# EAGLE schematic BMS Master Teensy V 2.22 move 4G (EAGLE 7.2.0)
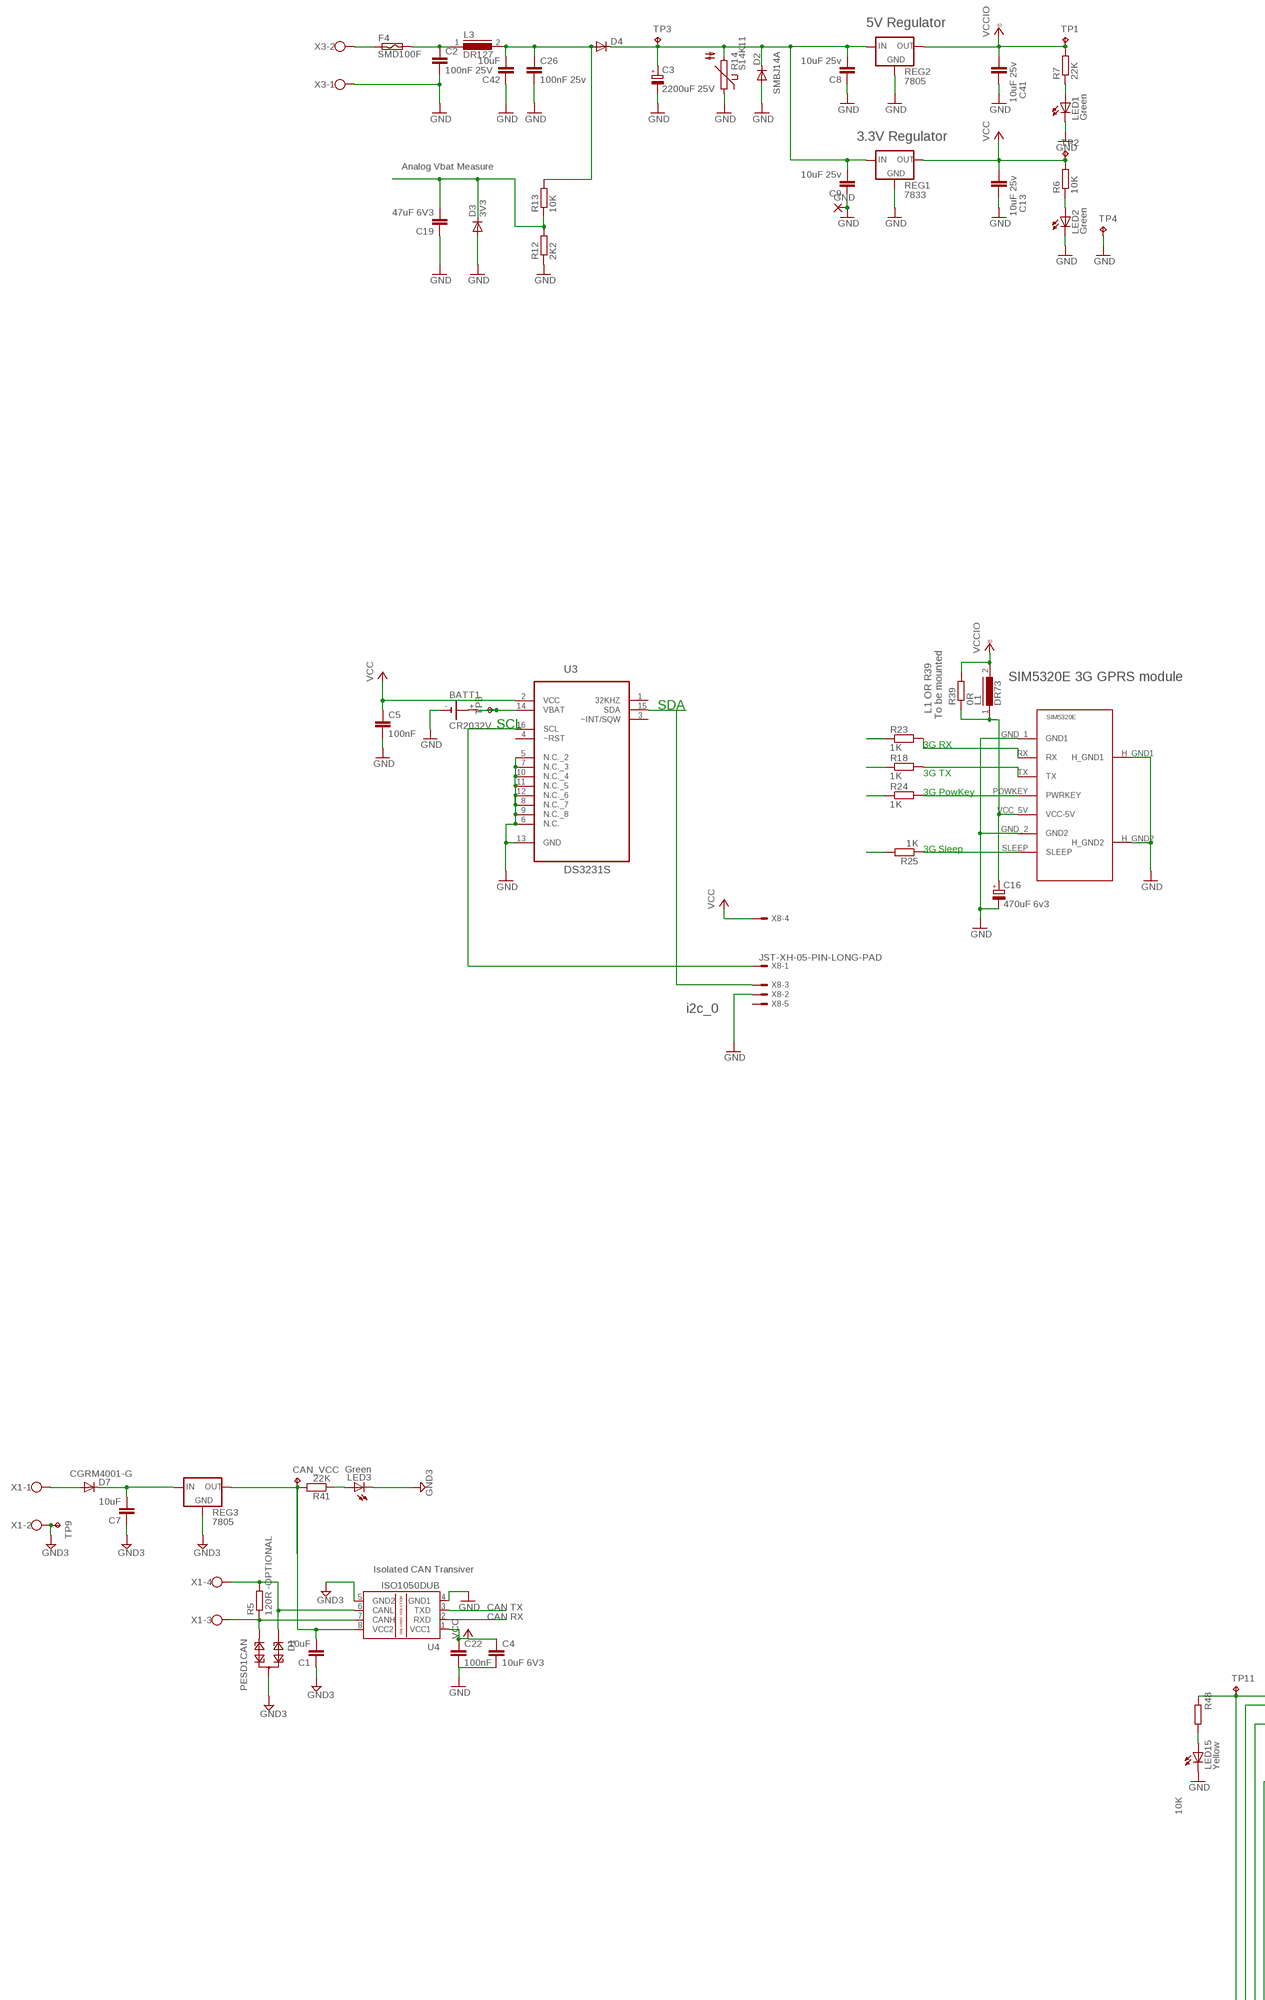
[diagram p0: schematic, sheet 1, part 1 of 3]
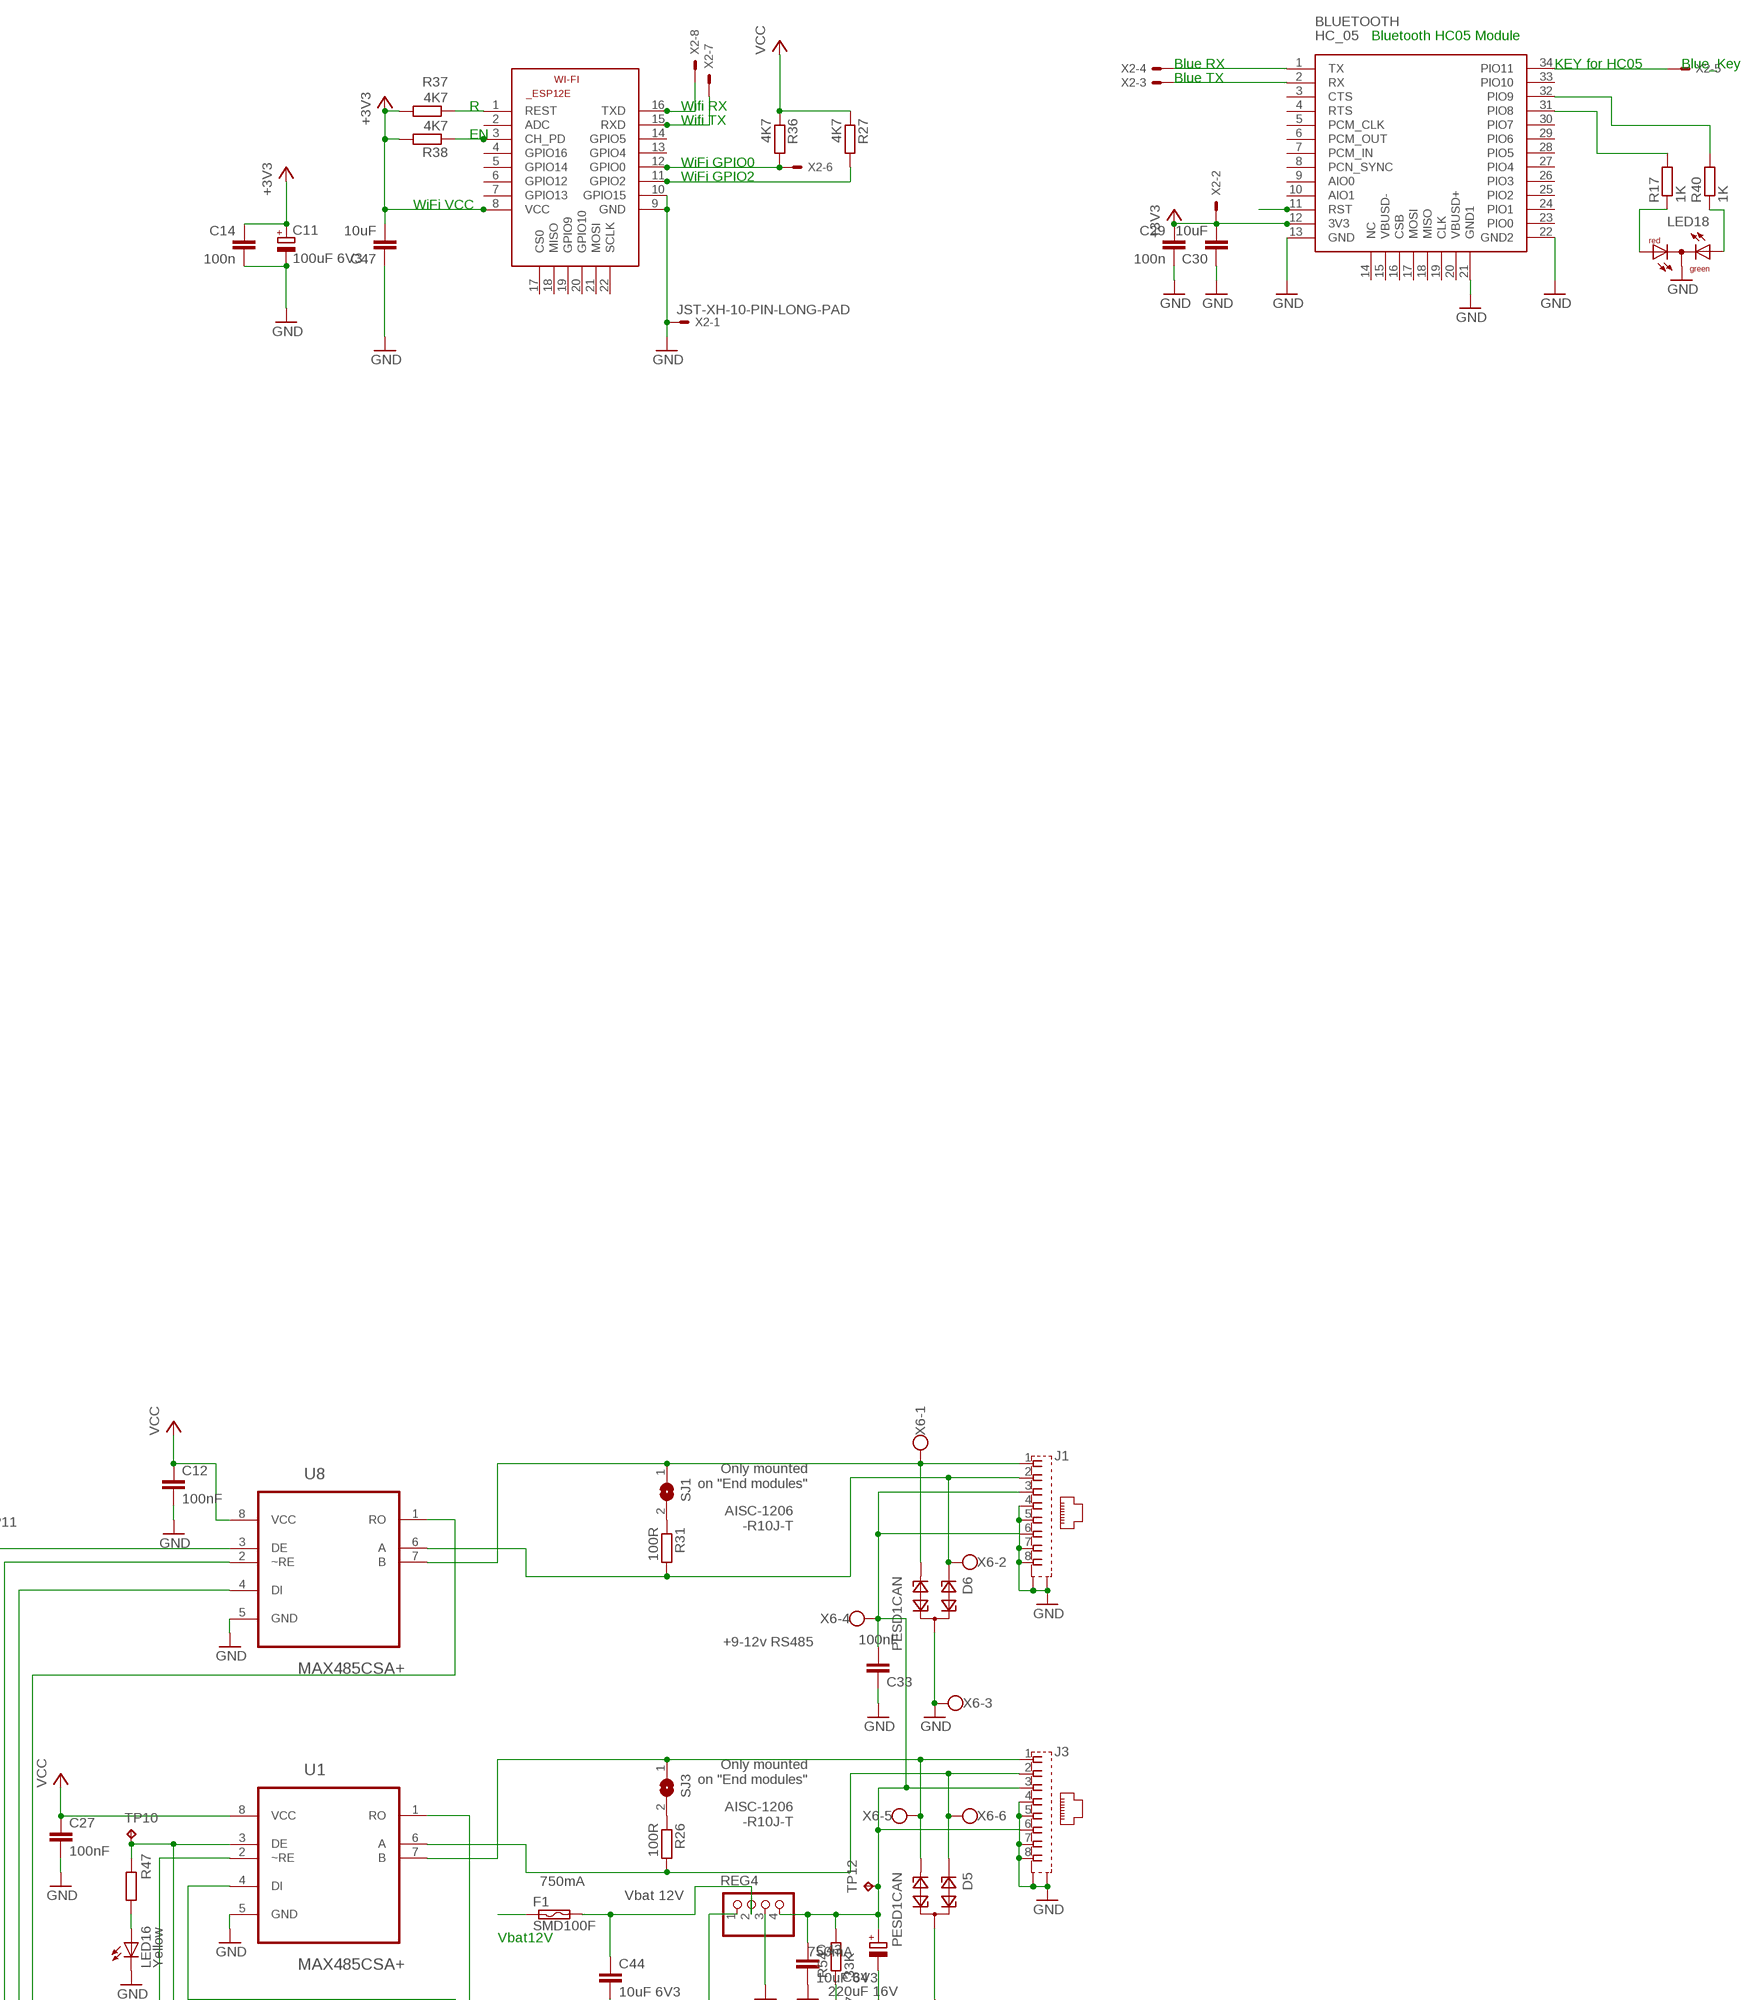
[diagram p1: schematic, sheet 1, part 2 of 3]
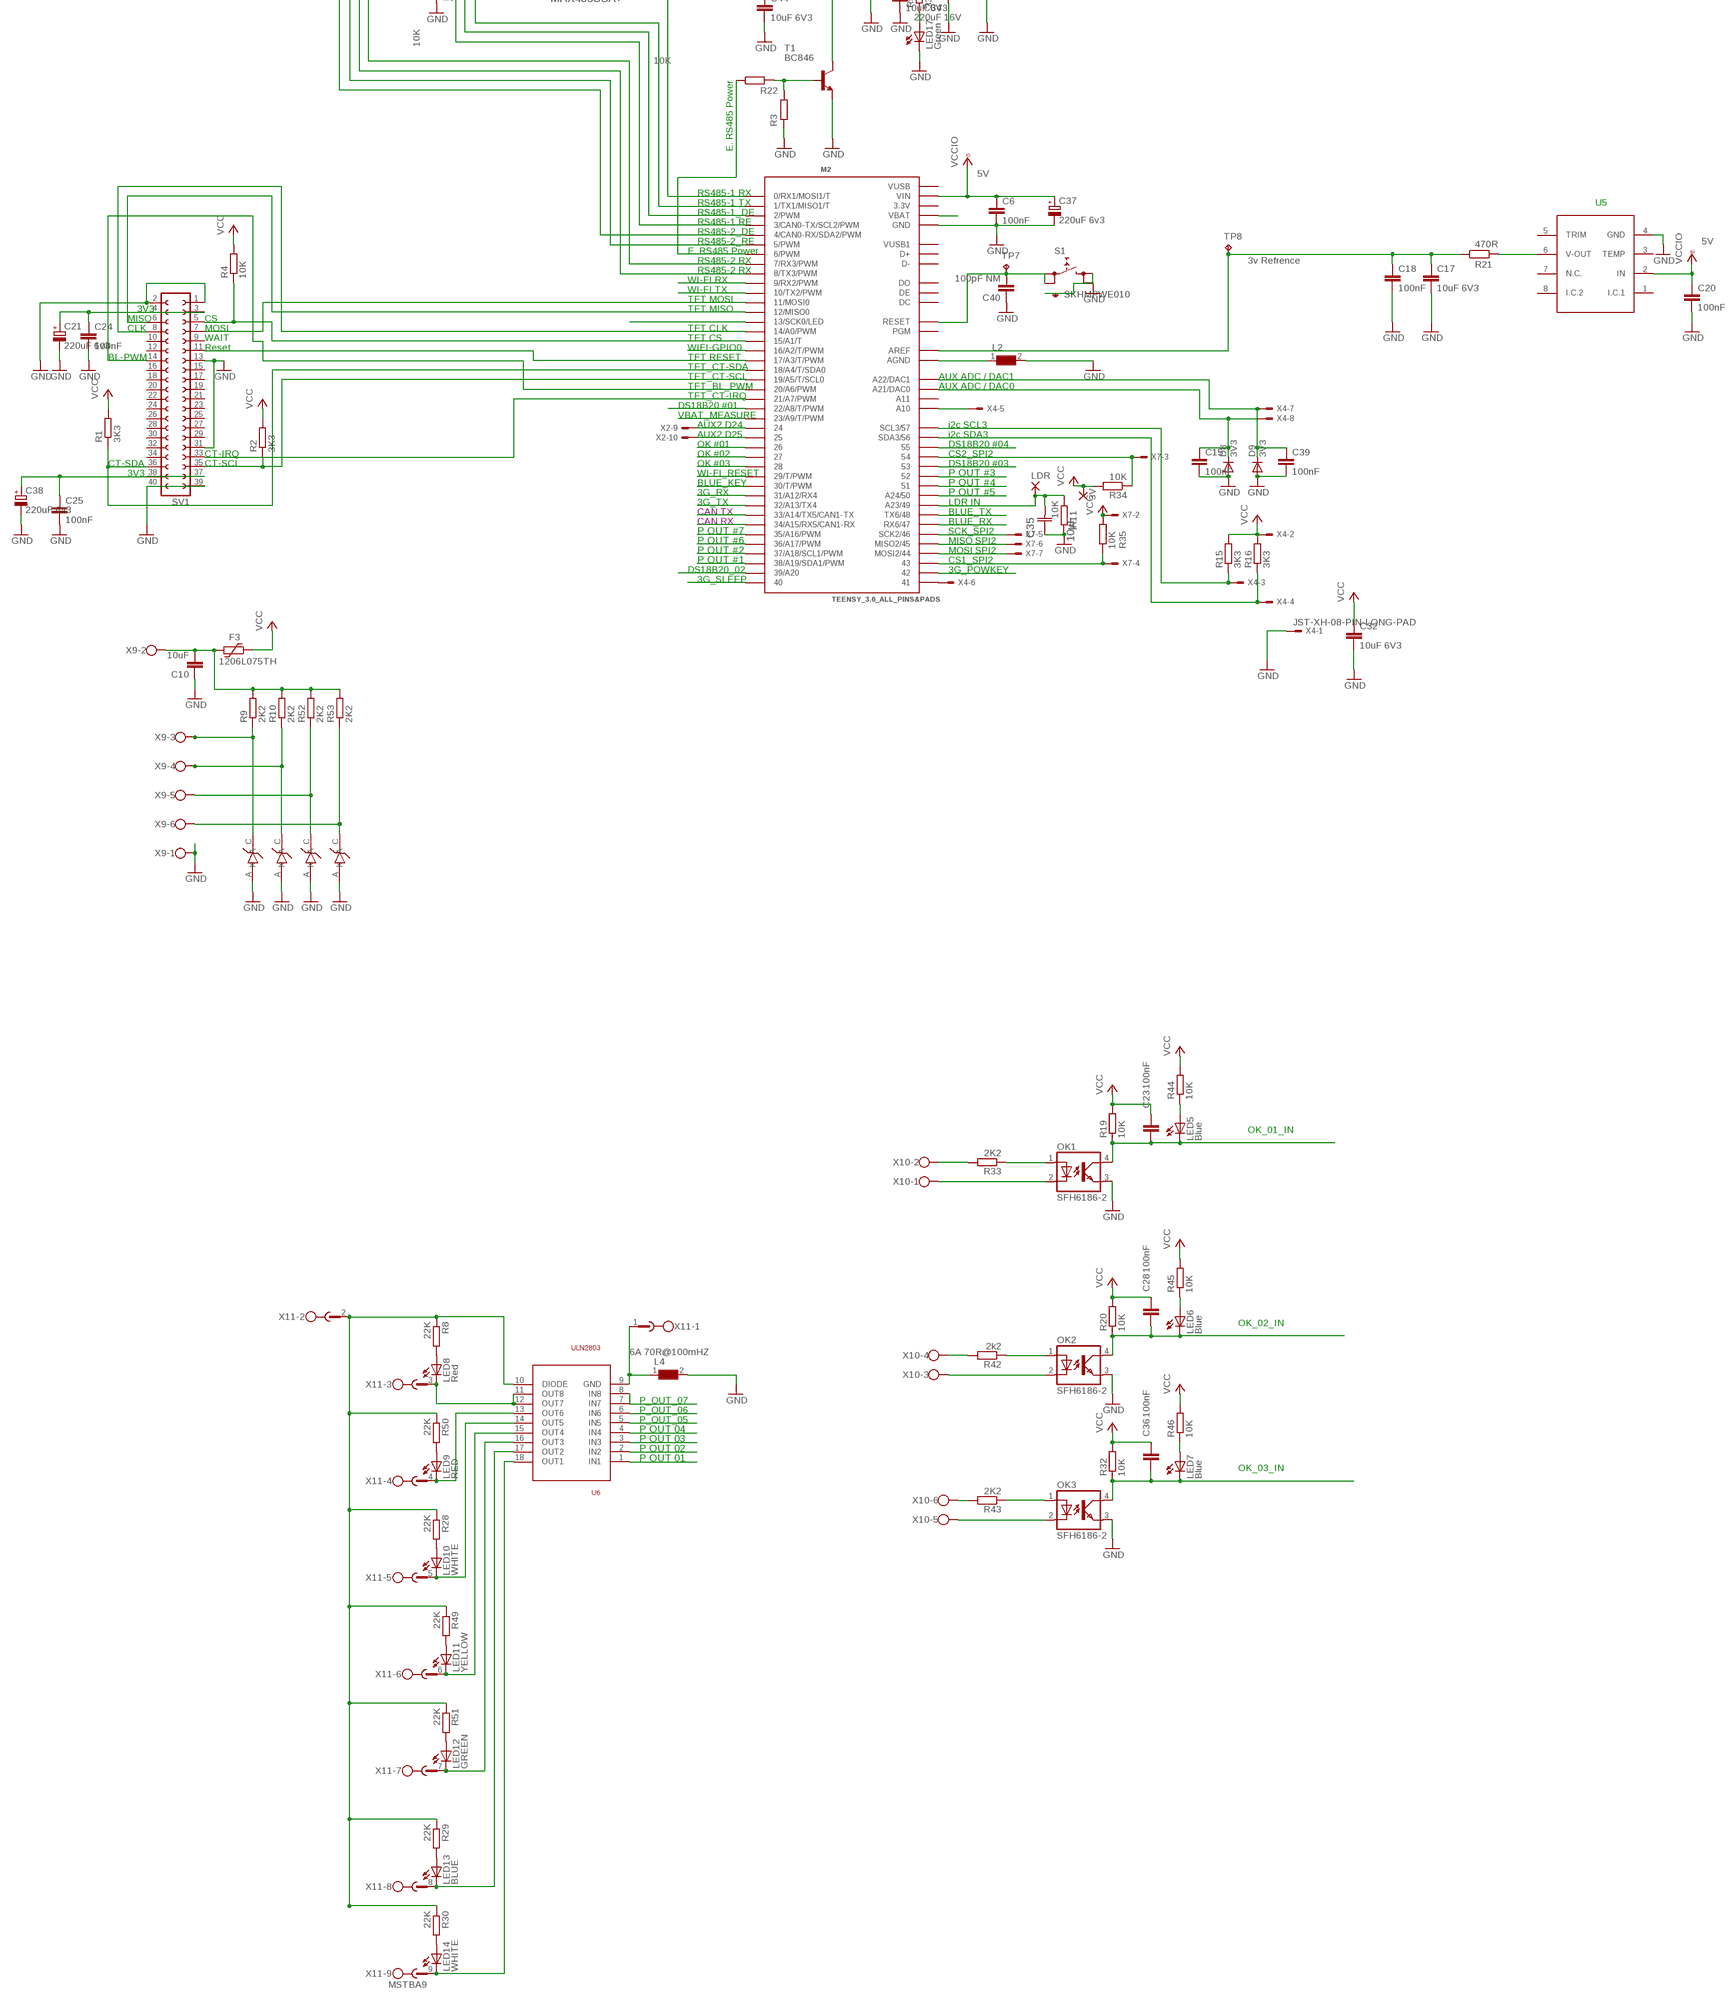
[diagram p2: schematic, sheet 1, part 3 of 3]

## Parts
3V  1,6/0,8  [1,6/0,8]
BATT1  CR2032V  [CR2032V]
BLUETOOTH  HC_05  [BLUETOOTH_SMD]
C1  10uF  C-EUC1206  [C1206]
C2  100nF 25V  C-EUC0805  [C0805]
C3  2200uF 25V  CPOL-EUE5-10.5  [E5-10,5]
C4  10uF 6V3  C-EUC1206  [C1206]
C5  100nF  C-EUC0603  [C0603]
C6  100nF  C-EUC0603  [C0603]
C7  10uF  C-EUC1206  [C1206]
C8  10uF 25v  C-EUC1206  [C1206]
C9  10uF 25v  C-EUC1206  [C1206]
C10  10uF  C-EUC1206  [C1206]
C11  100uF 6V3  CPOL-EUCT6032  [CT6032]
C12  100nF  C-EUC0603  [C0603]
C13  10uF 25v  C-EUC1206  [C1206]
C14  100n  C-EU0603-RND  [C0603-ROUND]
C15  100nF  C-EUC0603  [C0603]
C16  470uF 6v3  CPOL-EUCT7343  [CT7343]
C17  10uF 6V3  C-EUC1206  [C1206]
C18  100nF  C-EUC0603  [C0603]
C19  47uF 6V3  C-EUC1206  [C1206]
C20  100nF  C-EUC0603  [C0603]
C21  220uF 6v3  CPOL-EUCT7343  [CT7343]
C22  100nF  C-EUC0603  [C0603]
C23  100nF  C-EUC0805  [C0805]
C24  100nF  C-EUC0603  [C0603]
C25  100nF  C-EUC0603  [C0603]
C26  100nF 25v  C-EUC0603  [C0603]
C27  100nF  C-EUC0603  [C0603]
C28  100nF  C-EUC0805  [C0805]
C29  100n  C-EU0603-RND  [C0603-ROUND]
C30  10uF  C-EUC1206  [C1206]
C32  10uF 6V3  C-EUC1206  [C1206]
C33  100nF  C-EUC0603  [C0603]
C34  220uF 16V  CPOL-EUCT7343  [CT7343]
C35  10µF  0805ZD106KAT4A  [CAPC2012X140N]
C36  100nF  C-EUC0805  [C0805]
C37  220uF 6v3  CPOL-EUCT7343  [CT7343]
C38  220uF 6v3  CPOL-EUCT7343  [CT7343]
C39  100nF  C-EUC0603  [C0603]
C40  100pF NM  C-EUC0603  [C0603]
C41  10uF 25v  C-EUC1206  [C1206]
C42  10uF  C-EUC1206  [C1206]
C43  10uF 6V3  C-EUC1206  [C1206]
C44  10uF 6V3  C-EUC1206  [C1206]
C47  10uF  C-EUC1206  [C1206]
CAN_VCC  TPB2,54  [B2,54]
D1  PESD1CAN  [SOT23]
D2  SMBJ14A  DIODE-DO214AC  [DO214AC]
D3  3V3  DIODE-SOD80C  [SOD80C]
D4  DIODE-SMC  [SMC]
D5  PESD1CAN  [SOT23]
D6  PESD1CAN  [SOT23]
D7  CGRM4001-G  [SOD-123_MINI-SMA]
D8  3V3  DIODE-SOD80C  [SOD80C]
D9  3V3  DIODE-SOD80C  [SOD80C]
D10  SOD-323_ZENER_DIODE  [SOD323_ST]
D11  SOD-323_ZENER_DIODE  [SOD323_ST]
D12  SOD-323_ZENER_DIODE  [SOD323_ST]
D13  SOD-323_ZENER_DIODE  [SOD323_ST]
F1  SMD100F  [SMD050F]
F3  1206L075TH  [1206L]
F4  SMD100F  [SMD050F]
GND  1,6/0,9  [1,6/0,9]
J1  555153-1  [555153-1]
J3  555153-1  [555153-1]
L1  DR73  [DR73]
L2  WE-CBF-74279201_0805  [0805]
L3  DR127  [DR127]
L4  WE-CBF-742792510_1812  [1812]
LDR  1,6/0,8  [1,6/0,8]
LED1  Green  LEDCHIPLED_0805  [CHIPLED_0805]
LED2  Green  LEDCHIPLED_0805  [CHIPLED_0805]
LED3  Green  LEDCHIPLED_0805  [CHIPLED_0805]
LED5  Blue  LEDCHIPLED_0805  [CHIPLED_0805]
LED6  Blue  LEDCHIPLED_0805  [CHIPLED_0805]
LED7  Blue  LEDCHIPLED_0805  [CHIPLED_0805]
LED8  Red  LEDCHIP-LED0805  [CHIP-LED0805]
LED9  RED  LEDCHIP-LED0805  [CHIP-LED0805]
LED10  WHITE  LEDCHIP-LED0805  [CHIP-LED0805]
LED11  YELLOW  LEDCHIP-LED0805  [CHIP-LED0805]
LED12  GREEN  LEDCHIP-LED0805  [CHIP-LED0805]
LED13  BLUE  LEDCHIP-LED0805  [CHIP-LED0805]
LED14  WHITE  LEDCHIP-LED0805  [CHIP-LED0805]
LED15  Yellow  LEDCHIPLED_0805  [CHIPLED_0805]
LED16  Yellow  LEDCHIPLED_0805  [CHIPLED_0805]
LED17  Green  LEDCHIPLED_0805  [CHIPLED_0805]
LED18  DUOLED-RG-C  [DUOLED-C-5MM]
M1  SIM5320_MODULE  [SIM5320E_MODULE]
M2  TEENSY_3.6_ALL_PINS&PADS  [TEENSY_3.6_ALL_PINS&PADS]
OK1  SFH6186-2  [SMD4-7]
OK2  SFH6186-2  [SMD4-7]
OK3  SFH6186-2  [SMD4-7]
R1  3K3  R-EU_R0603  [R0603]
R2  3K3  R-EU_R0603  [R0603]
R3  1M  R-EU_R0603  [R0603]
R4  10K  R-EU_R0603  [R0603]
R5  120R -OPTIONAL  R-EU_R0603  [R0603]
R6  10K  R-EU_R0805  [R0805]
R7  22K  R-EU_R0805  [R0805]
R8  22K  R-EU_R0603  [R0603]
R9  2K2  R-EU_R0603  [R0603]
R10  2K2  R-EU_R0603  [R0603]
R11  10K  R-EU_R0603  [R0603]
R12  2K2  R-EU_R0603  [R0603]
R13  10K  R-EU_R0603  [R0603]
R14  S14K11  [S14K11]
R15  3K3  R-EU_R0603  [R0603]
R16  3K3  R-EU_R0603  [R0603]
R17  1K  R-EU_R0603  [R0603]
R18  1K  R-EU_R0603  [R0603]
R19  10K  R-EU_R0805  [R0805]
R20  10K  R-EU_R0805  [R0805]
R21  470R  R-EU_R0603  [R0603]
R22  10K  R-EU_R0603  [R0603]
R23  1K  R-EU_R0603  [R0603]
R24  1K  R-EU_R0603  [R0603]
R25  1K  R-EU_R0603  [R0603]
R26  100R  R-EU_R0805  [R0805]
R27  4K7  R-EU_R0603  [R0603]
R28  22K  R-EU_R0603  [R0603]
R29  22K  R-EU_R0603  [R0603]
R30  22K  R-EU_R0603  [R0603]
R31  100R  R-EU_R0805  [R0805]
R32  10K  R-EU_R0805  [R0805]
R33  2K2  R-EU_R0805  [R0805]
R34  10K  R-EU_R0603  [R0603]
R35  10K  R-EU_R0603  [R0603]
R36  4K7  R-EU_R0603  [R0603]
R37  4K7  R-EU_R0603  [R0603]
R38  4K7  R-EU_R0603  [R0603]
R39  0R  R-EU_R0603  [R0603]
R40  1K  R-EU_R0603  [R0603]
R41  22K  R-EU_R0805  [R0805]
R42  2k2  R-EU_R0805  [R0805]
R43  2K2  R-EU_R0805  [R0805]
R44  10K  R-EU_R0805  [R0805]
R45  10K  R-EU_R0805  [R0805]
R46  10K  R-EU_R0805  [R0805]
R47  10K  R-EU_R0603  [R0603]
R48  10K  R-EU_R0603  [R0603]
R49  22K  R-EU_R0603  [R0603]
R50  22K  R-EU_R0603  [R0603]
R51  22K  R-EU_R0603  [R0603]
R52  2K2  R-EU_R0603  [R0603]
R53  2K2  R-EU_R0603  [R0603]
R54  33K  R-EU_R0805  [R0805]
REG1  7833  78XXS  [78XXS]
REG2  7805  78XXS  [78XXS]
REG3  7805  78XXS  [78XXS]
REG4  PINHD-1X4  [1X04]
S1  SKHMPWE010  [SKHMPXE010]
SJ1  SJ  [SJ]
SJ3  SJ  [SJ]
SV1  FE20-2  [FE20-2]
T1  BC846  [SOT23]
TP1  TPB2,54  [B2,54]
TP2  TPB2,54  [B2,54]
TP3  TPB2,54  [B2,54]
TP4  TPB2,54  [B2,54]
TP5  TPB2,54  [B2,54]
TP7  TPB2,54  [B2,54]
TP8  TPB2,54  [B2,54]
TP9  TPB2,54  [B2,54]
TP10  TPB1,27  [B1,27]
TP11  TPB1,27  [B1,27]
TP12  TPB2,54  [B2,54]
U1  MAX485CSA+  [SOIC127P600X175-8N]
U3  DS3231S  [SOIC127P1032X265-16N]
U4  ISO1050DUB  [DUB-R-PDSO-G8]
U5  U5  MAX6177AASA+  [MAX6177AASA+]
U6  ULN2803  [SO18L]
U8  MAX485CSA+  [SOIC127P600X175-8N]
WI-FI  ESP8266-12EESP12E  [ESP8266-ESP12E]
X1  W237-4  [W237-4]
X2  JST-XH-10-PIN-LONG-PAD  [JST-XH-10-PACKAGE-LONG-PAD]
X3  W237-102  [W237-102]
X4  JST-XH-08-PIN-LONG-PAD  [JST-XH-08-PACKAGE-LONG-PAD]
X6  W237-6  [W237-6]
X7  JST-XH-07-PIN-LONG-PAD  [JST-XH-07-PACKAGE-LONG-PAD]
X8  JST-XH-05-PIN-LONG-PAD  [JST-XH-05-PACKAGE-LONG-PAD]
X9  W237-6  [W237-6]
X10  W237-6  [W237-6]
X11  MSTBA9  [MSTBA9]

## Nets
3G_POWKEY: M2.42 R24.1
3G_RX: M2.31/A12(31/A12/RX4) R18.1
3G_SLEEP: M2.40 R25.2
3G_TX: M2.32/A13(32/A13/TX4) R23.1
18B20_VCC [power]: C10.2 F3.2 R9.2 R10.2 R52.2 R53.2 X9.2
A10: M2.A10 X4.5
A- [RS485 Differential]: D5.1 J3.2 R26.2 U1.6(A) X6.6
A-1 [RS485 Differential]: D6.1 J1.2 R31.2 U8.6(A) X6.2
AUX_ADC-DAC_1: C39.1 D9.C M2.A22(A22/DAC1) X4.7
B+ [RS485 Differential]: D5.2 J3.1 SJ3.1 U1.7(B) X6.5
B+1 [RS485 Differential]: D6.2 J1.1 SJ1.1 U8.7(B) X6.1
BL-PWM: M2.20/A6(20/A6/PWM) SV1.14
BLUE_KEY: BLUETOOTH.34(PIO11) M2.30(30/T/PWM) X2.5
BLUE_RX: BLUETOOTH.1(TX) M2.47(RX6/47) X2.4
BLUE_TX: BLUETOOTH.2(RX) M2.48(TX6/48) X2.3
CAN-L [RS485 Differential]: D1.1 R5.2 U4.6(CANL) X1.4
CAN_RX [RS485 Differential]: M2.34/A15(34/A15/RX5/CAN1-RX) U4.2(RXD)
CAN_TX [RS485 Differential]: M2.33/A14(33/A14/TX5/CAN1-TX) U4.3(TXD)
CAN_VBAT_12V [power]: D7.A X1.1
CHARGE_A(1): C15.1 D8.C M2.A21(A21/DAC0) X4.8
CS1_SPI2: M2.43 R35.1 X7.4
CS2_SPI2: M2.54 R34.1 X7.3
CT-IRQ: M2.21/A7(21/A7/PWM) SV1.33
D24: M2.24 X2.9
D25: M2.25 X2.10
D41: M2.41 X4.6
DCIN [power]: C33.1 C34.+ C43.1 J1.3 J1.6 J3.3 J3.6 R54.2 REG4.4 TP12.TP X6.4
DS18B20_01: D13.C(K) M2.22/A8(22/A8/T/PWM) R9.1 X9.3
DS18B20_02: D12.C(K) M2.39/A20 R10.1 X9.4
DS18B20_03: D11.C(K) M2.53 R52.1 X9.5
DS18B20_04: D10.C(K) M2.55 R53.1 X9.6
E_RS485_POWER: M2.6(6/PWM) R22.1
GND: BATT1.- BLUETOOTH.13(GND) BLUETOOTH.21(GND1) BLUETOOTH.22(GND2) C2.2 C3.- C4.2 C5.2 C6.2 C8.1 C9.1 C10.1 C11.- C12.2 C13.1 C14.2 C15.2 C16.- C17.2 C18.2 C19.1 C20.2 C21.- C22.2 C24.2 C25.2 C26.2 C27.2 C29.2 C30.1 C32.2 C33.2 C34.- C35.1(C1) C37.- C38.- C39.2 C40.1 C41.1 C42.1 C43.2 C44.2 C47.1 D2.A D3.A D5.3 D6.3 D8.A D9.A D10.A D11.A D12.A D13.A GND.1(P) J1.4 J1.5 J1.7 J1.8 J1.G1(S1) J1.G2(S2) J3.4 J3.5 J3.7 J3.8 J3.G1(S1) J3.G2(S2) L2.2 L4.2 LED1.C LED2.C LED15.C LED16.C LED17.C LED18.C M1.GND_1(GND1) M1.GND_2(GND2) M1.H_GND1 M1.H_GND2 M2.GND M2.GND1(GND) M2.GND2(GND) M2.GND3(GND) M2.GND4(GND) M2.GND5(GND) M2.GND6(GND) OK1.3(EMIT) OK2.3(EMIT) OK3.3(EMIT) R3.2 R11.2 R12.1 R14.1 REG1.GND REG2.GND REG4.3 S1.3(2.1) S1.4(2.2) S1.5(SH) SV1.1 SV1.2 SV1.13 SV1.31 SV1.39 SV1.40 T1.2(E) TP4.TP U1.5(GND) U3.5(N.C._2) U3.6(N.C.) U3.7(N.C._3) U3.8(N.C._7) U3.9(N.C._8) U3.10(N.C._4) U3.11(N.C._5) U3.12(N.C._6) U3.13(GND) U4.4(GND1) U5.4(GND) U8.5(GND) WI-FI.9(GND) WI-FI.10(GPIO15) X2.1 X3.1 X4.1 X6.3 X8.2 X9.1
GND3-CAN: C1.1 C7.1 D1.3 LED3.C REG3.GND TP9.TP U4.5(GND2) X1.2 ; supply symbol labelled GND3
GND-FILTERED: L4.1 U6.9(GND) X11.1
LDR_A23: C35.2(C2) LDR.1(P) M2.49(A23/49) R11.1
MISO_SPI2: M2.45(MISO2/45) X7.6
MOSI_SPI2: M2.44(MOSI2/44) X7.7
N$1: M2.0(0/RX1/MOSI1/T) U1.1(RO)
N$2: M2.1(1/TX1/MISO1/T) U1.4(DI)
N$4: L2.1 M2.AGND
N$6: LED17.A R54.1
N$7 [power]: C2.1 F4.2 L3.1
N$8: LED16.A R47.1
N$9: R3.1 R22.2 T1.1(B)
N$10: LED15.A R48.1
N$11 [power]: F4.1 X3.2
N$12: LED11.A R49.2
N$13 [power]: BATT1.+ TP5.TP U3.14(VBAT)
N$14: M1.TX R18.2
N$15: LED18.AR R17.1
N$16: M2.VBAT
N$17: LED3.A R41.1
N$18: LED9.A R50.2
N$19: M1.RX R23.2
N$20 [RS485 Differential]: D1.2 R5.1 U4.7(CANH) X1.3
N$21: LED18.AX(AG) R40.1
N$22: LED12.A R51.2
N$23: LED2.A R6.1
N$24: LED1.A R7.1
N$25 [power]: C44.1 F1.2 REG4.2
N$26: M2.13(13/SCK0/LED)
N$27: LED8.A R8.2
N$31: OK1.1(A) R33.1
N$32: BLUETOOTH.11(RST)
N$33: R33.2 X10.2
N$34: OK3.1(A) R43.1
N$35: R43.2 X10.6
N$36: R42.2 X10.4
N$37: BLUETOOTH.32(PIO9) R40.2
N$38: BLUETOOTH.31(PIO8) R17.2
N$39: R26.1 SJ3.2
N$42: R21.2 U5.6(V-OUT)
N$45: M1.POWKEY(PWRKEY) R24.2
N$46: M1.SLEEP R25.1
N$49: OK2.2(C) X10.3
N$50: OK3.2(C) X10.5
N$51 [power]: C7.2 D7.C REG3.IN
N$52: LED10.A R28.2
N$53: LED13.A R29.2
N$54: LED14.A R30.2
N$55: OK1.2(C) X10.1
N$56: OK2.1(A) R42.1
N$58: LED5.A R44.1
N$59: LED6.A R45.1
N$60: R31.1 SJ1.2
N$62: LED7.A R46.1
OK_01_IN: C23.2 LED5.C M2.26 OK1.4(COL) R19.1
OK_02_IN: C28.2 LED6.C M2.27 OK2.4(COL) R20.1
OK_03_IN: C36.2 LED7.C M2.28 OK3.4(COL) R32.1
OUT_01: LED14.C U6.18(OUT1) X11.9
OUT_02 [power]: LED13.C U6.17(OUT2) X11.8
OUT_03 [power]: LED12.C U6.16(OUT3) X11.7
OUT_04 [power]: LED11.C U6.15(OUT4) X11.6
OUT_05 [power]: LED10.C U6.14(OUT5) X11.5
OUT_06 [power]: LED9.C U6.13(OUT6) X11.4
OUT_07 [power]: LED8.C U6.11(OUT8) U6.12(OUT7) X11.3
OUT_VCC_VOLTAGE [power]: R8.1 R28.1 R29.1 R30.1 R49.1 R50.1 R51.1 U6.10(DIODE) X11.2
P_OUT_01: M2.38/A19(38/A19/SDA1/PWM) U6.1(IN1)
P_OUT_02: M2.37/A18(37/A18/SCL1/PWM) U6.2(IN2)
P_OUT_03: M2.52 U6.3(IN3)
P_OUT_04: M2.51 U6.4(IN4)
P_OUT_05: M2.50(A24/50) U6.5(IN5)
P_OUT_06: M2.36/A17(36/A17/PWM) U6.6(IN6)
P_OUT_07: M2.35/A16(35/A16/PWM) U6.7(IN7) U6.8(IN8)
RESET [power]: C40.2 M2.RESET S1.1(1.1) S1.2(1.2) TP7.TP
RS485-1_DE: M2.2(2/PWM) R47.2 TP10.TP U1.3(DE)
RS485-1_RE: M2.3(3/CAN0-TX/SCL2/PWM) U1.2(~RE)
RS485-2_DE: M2.4(4/CAN0-RX/SDA2/PWM) R48.2 TP11.TP U8.3(DE)
RS485-2_RE: M2.5(5/PWM) U8.2(~RE)
RS485-2_RX: M2.7(7/RX3/PWM) U8.1(RO)
RS485-2_TX: M2.8(8/TX3/PWM) U8.4(DI)
RS485_POWER: REG4.1 T1.3(C)
SCK_SPI2: M2.46(SCK2/46) X7.5
SCL: M2.19/A5(19/A5/T/SCL0) R2.1 SV1.35 U3.16(SCL) X8.1
SCL3: M2.57(SCL3/57) R15.1 X4.3
SDA: M2.18/A4(18/A4/T/SDA0) R1.1 SV1.36 U3.15(SDA) X8.3
SDA3: M2.56(SDA3/56) R16.1 X4.4
SIM5320E_VCC [power]: C16.+ L1.1 M1.VCC_5V(VCC-5V) R39.1
TFT-SCK: M2.14/A0(14/A0/PWM) SV1.8
TFT_CS: M2.15/A1(15/A1/T) R4.1 SV1.5
TFT_MISO: M2.12(12/MISO0) SV1.6
TFT_MOSI: M2.11(11/MOSI0) SV1.7
TFT_RESET: M2.17/A3(17/A3/T/PWM) SV1.11
VBAT12V [power]: C3.+ C8.2 C9.2 D2.C D4.C F1.1 R14.2 REG1.IN REG2.IN TP3.TP
VBAT_12V [power]: C26.1 C42.2 D4.A L3.2 R13.2
VBAT_MEASURE: C19.2 D3.C M2.23/A9(23/A9/T/PWM) R12.2 R13.1
VCC3V1 [power]: C1.2 CAN_VCC.TP R41.2 REG3.OUT U4.8(VCC2)
VCC3V3 [power]: 3V.1(P) BLUETOOTH.12(3V3) C4.1 C5.1 C11.+ C12.1 C13.2 C14.1 C21.+ C22.1 C23.1 C24.1 C25.1 C27.1 C28.1 C29.1 C30.2 C32.1 C36.1 C38.+ C47.2 F3.1 R1.2 R2.2 R4.2 R6.2 R15.2 R16.2 R19.2 R20.2 R27.1 R32.2 R34.2 R35.2 R36.1 R37.2 R38.2 R44.2 R45.2 R46.2 REG1.OUT SV1.3 SV1.4 SV1.37 SV1.38 TP2.TP U1.8(VCC) U3.2(VCC) U4.1(VCC1) U8.8(VCC) WI-FI.8(VCC) X2.2 X4.2 X7.2 X8.4 ; supply symbol labelled VCC, +3V3
VCC5V [power]: C6.1 C20.1 C37.+ C41.2 L1.2 M2.VIN R7.2 R39.2 REG2.OUT TP1.TP U5.2(IN) ; supply symbol labelled VCCIO
VREF_3V: C17.1 C18.1 M2.AREF R21.1 TP8.TP
WI-FI_RESET: M2.29(29/T/PWM) R37.1 WI-FI.1(REST)
WI-FI_RX: M2.9(9/RX2/PWM) WI-FI.16(TXD) X2.8
WI-FI_TX: M2.10(10/TX2/PWM) WI-FI.15(RXD) X2.7
WIFI-CH_PD: R38.1 WI-FI.3(CH_PD)
WIFI-GPIO0: M2.16/A2(16/A2/T/PWM) R36.2 WI-FI.12(GPIO0) X2.6
WIFI-GPIO2: R27.2 WI-FI.11(GPIO2)
Unconnected: BATT1.+@1(+) BLUETOOTH.3(CTS) BLUETOOTH.4(RTS) BLUETOOTH.5(PCM_CLK) BLUETOOTH.6(PCM_OUT) BLUETOOTH.7(PCM_IN) BLUETOOTH.8(PCN_SYNC) BLUETOOTH.9(AIO0) BLUETOOTH.10(AIO1) BLUETOOTH.14(NC) BLUETOOTH.15(VBUSD-) BLUETOOTH.16(CSB) BLUETOOTH.17(MOSI) BLUETOOTH.18(MISO) BLUETOOTH.19(CLK) BLUETOOTH.20(VBUSD+) BLUETOOTH.23(PIO0) BLUETOOTH.24(PIO1) BLUETOOTH.25(PIO2) BLUETOOTH.26(PIO3) BLUETOOTH.27(PIO4) BLUETOOTH.28(PIO5) BLUETOOTH.29(PIO6) BLUETOOTH.30(PIO7) BLUETOOTH.33(PIO10) M2.A11 M2.D+ M2.D- M2.DC M2.DE M2.DO M2.PGM SV1.9 SV1.10 SV1.12 SV1.15 SV1.16 SV1.17 SV1.18 SV1.19 SV1.20 SV1.21 SV1.22 SV1.23 SV1.24 SV1.25 SV1.26 SV1.27 SV1.28 SV1.29 SV1.30 SV1.32 SV1.34 U3.1(32KHZ) U3.3(~INT/SQW) U3.4(~RST) U5.1(I.C.1) U5.3(TEMP) U5.5(TRIM) U5.7(N.C.) U5.8(I.C.2) WI-FI.2(ADC) WI-FI.4(GPIO16) WI-FI.5(GPIO14) WI-FI.6(GPIO12) WI-FI.7(GPIO13) WI-FI.13(GPIO4) WI-FI.14(GPIO5) WI-FI.17(CS0) WI-FI.18(MISO) WI-FI.19(GPIO9) WI-FI.20(GPIO10) WI-FI.21(MOSI) WI-FI.22(SCLK) X7.1 X8.5

## Notes on the sheet
- 5V Regulator
- 3.3V Regulator
- Analog Vbat Measure
- SIM5320E 3G GPRS module | Bluetooth HC05 Module
- Blue RX | KEY for HC05 | Blue_Key
- SDA | Blue TX
- L1 OR R39
  To be mounted
- SCL | R | Wifi RX
- Wifi TX
- 3G RX | EN
- WiFi GPIO0
- 3G TX | WiFi GPIO2
- 3G PowKey | WiFi VCC
- 3G Sleep
- i2c_0
- Isolated CAN Transiver
- CAN TX
- CAN RX
- Only mounted
  on "End modules"
- AISC-1206
  -R10J-T
- +9-12v RS485
- Only mounted
  on "End modules"
- AISC-1206
  -R10J-T
- 750mA
- Vbat 12V
- Vbat12V
- 750mA
- E. RS485 Power
- 5V
- RS485-1 RX
- RS485-1 TX | U5
- RS485-1_DE
- RS485-1 RE
- RS485-2_DE
- RS485-2_RE | 5V
- E. RS485 Power
- RS485-2 RX | 3v Refrence
- RS485-2 RX
- WI-FI RX
- WI-FI TX
- TFT MOSI
- 3V3 | TFT MISO
- MISO | CS
- CLK | MOSI | TFT CLK
- WAIT | TFT CS
- Reset | WIFI-GPIO0
- BL-PWM | TFT RESET
- TFT_CT-SDA
- TFT_CT-SCL | AUX ADC / DAC1
- TFT_BL_PWM | AUX ADC / DAC0
- TFT_CT-IRQ
- DS18B20 #01
- VBAT_MEASURE
- AUX2 D24 | i2c SCL3
- AUX2 D25 | i2c SDA3
- OK #01 | DS18B20 #04
- CT-IRQ | OK #02 | CS2_SPI2
- CT-SDA | CT-SCL | OK #03 | DS18B20 #03
- 3V3 | WI-FI_RESET | P OUT #3
- BLUE_KEY | P OUT #4
- 3G_RX | P OUT #5
- 3G_TX | LDR IN
- CAN TX | BLUE_TX
- CAN RX | BLUE_RX
- P OUT #7 | SCK_SPI2
- P OUT #6 | MISO SPI2
- P OUT #2 | MOSI SPI2
- P OUT #1 | CS1_SPI2
- DS18B20_02 | 3G_POWKEY
- 3G_SLEEP
- OK_01_IN
- OK_02_IN
- 6A 70R@100mHZ
- P_OUT_07
- P_OUT_06
- P_OUT_05
- P OUT 04
- P OUT 03
- P OUT 02
- P OUT 01
- OK_03_IN

## Power pins joined to a net without a drawn wire
3.3V: M2.3.3V M2.3.3V2(3.3V) M2.3.3V3(3.3V) M2.3.3V4(3.3V)
VUSB: M2.VUSB
VUSB1: M2.VUSB1

## Library data of the parts
3V LDR = wirepad:1,6/0,8: THROUGH-HOLE PAD
BATT1 = battery:CR2032V: LI BATTERY Varta
BLUETOOTH = SerialPortBluetooth:HC_05
C1 C2 C4 C7 C10 C17 C23 C28 C30 C32 C33 C36 C42-C44 C47 = rcl:C-EU: CAPACITOR, European symbol
C3 C11 C16 C21 C34 C37 C38 = rcl:CPOL-EU: POLARIZED CAPACITOR, European symbol
C5 C6 C8 C9 C12 C13 C15 C18-C20 C22 C24-C27 C39-C41 = resistor:C-EU: CAPACITOR, European symbol
C14 C29 = SmartPrj:C-EU: CAPACITOR, European symbol
C35 = AVX_By_element14_Batch_1:0805ZD106KAT4A: Capacitor 0805; MPN: 0805ZD106KAT4A; OC_FARNELL: -; OC_NEWARK: 66M3426; SUPPLIER: AVX; TOLERANCE: ±10%; VOLTAGERATING: 10V
CAN_VCC TP1-TP5 TP7-TP12 = testpad:TP: Test pad
D1 D5 D6 = diode:PESD1CAN: CAN bus ESD protection diode Source: http://www.nxp.com/documents/data_sheet/PESD1CAN.pdf
D2-D4 D8 D9 = diode:DIODE-: DIODE
D7 = diode:CGRM400*-G: Molded plasitc,JEDEC SOD-123/Mini SMA Source: Comchip CGRM4001-G.pdf
D10-D13 = diode:SOD-323_ZENER_DIODE
F1 F4 = switch-raychem:SMD*F: PolySwitch (TM) Resettable Device Source: Data sheet <http://www.farnell.com/datasheets/13482.pdf>
F3 = polyfuse-smd_10:?: Polyfuse Resettable PTC Source: http://www.littelfuse.com/products/resettable-ptcs.aspx; MF: Littelfuse; MPN: 1206L075TH; OC_FARNELL: 1822204; OC_NEWARK: 64R8192
GND = wirepad:1,6/0,9: THROUGH-HOLE PAD
J1 J3 = con-amp:555153-1: AMP connector
L1 = inductors:DR73: High Power Density, High Efficiency, Shielded Inductors Source: coiltronics_dr_series.pdf
L2 = WE-CBF:WE-CBF: SMD EMI Suppression Ferrite Beads WE-CBF - Excellent anti-EMI properties - Low DC-restistance - Impedances till 3000 ohms - Rated current up to 6 A -- Reliable Ni-Sn electrodes -- Perfect as data lined filter and for uncoupling of distribution voltage; MPN: 74279201; OC_FARNELL: 1635708; OC_NEWARK: 08P2359; PACKAGE: IND-0805; SUPPLIER: Wuerth Elektronik
L3 = inductors:DR127: High Power Density, High Efficiency, Shielded Inductors Source: coiltronics_dr_series.pdf
L4 = WE-CBF:WE-CBF: SMD EMI Suppression Ferrite Beads WE-CBF - Excellent anti-EMI properties - Low DC-restistance - Impedances till 3000 ohms - Rated current up to 6 A -- Reliable Ni-Sn electrodes -- Perfect as data lined filter and for uncoupling of distribution voltage; MPN: 742792510; OC_FARNELL: 1635777; OC_NEWARK: 08P2421; PACKAGE: IND-1812; SUPPLIER: Wuerth Elektronik
LED1-LED3 LED5-LED17 = led:LED: LED OSRAM: - CHIPLED LG R971, LG N971, LY N971, LG Q971, LY Q971, LO R971, LY R971 LH N974, LH R974 LS Q976, LO Q976, LY Q976 LO Q996 - Hyper CHIPLED LW Q18S LB Q993, LB Q99A, LB R99A - SideLED LS A670, LO A670, LY A670, LG A670, LP A670 LB A673, LV A673, LT A673, LW A673 LH A674 LY A675 LS A676, LA A676, LO A676, LY A676, LW A676 LS A679, LY A679, LG A679 - Hyper Micro SIDELED® LS Y876, LA Y876, LO Y876, LY Y876 LT Y87S - SmartLED LW L88C, LW L88S LB L89C, LB L89S, LG L890 LS L89K, LO L89K, LY L89K LS L896, LA L896, LO L896, LY L896 - TOPLED LS T670, LO T670, LY T670, LG T670, LP T670 LSG T670, LSP T670, LSY T670, LOP T670, LYG T670 LG T671, LOG T671, LSG T671 LB T673, LV T673, LT T673, LW T673 LH T674 LS T676, LA T676, LO T676, LY T676, LB T676, LH T676, LSB T676, LW T676 LB T67C, LV T67C, LT T67C, LS T67K, LO T67K, LY T67K, LW E67C LS E67B, LA E67B, LO E67B, LY E67B, LB E67C, LV E67C, LT E67C LW T67C LS T679, LY T679, LG T679 LS T770, LO T770, LY T770, LG T770, LP T770 LB T773, LV T773, LT T773, LW T773 LH T774 LS E675, LA E675, LY E675, LS T675 LS T776, LA T776, LO T776, LY T776, LB T776 LHGB T686 LT T68C, LB T68C - Hyper Mini TOPLED® LB M676 - Mini TOPLED Santana® LG M470 LS M47K, LO M47K, LY M47K Source: http://www.osram.convergy.de - LUMILED® LXK2-PW12-R00, LXK2-PW12-S00, LXK2-PW14-U00, LXK2-PW14-V00 LXK2-PM12-R00, LXK2-PM12-S00, LXK2-PM14-U00 LXK2-PE12-Q00, LXK2-PE12-R00, LXK2-PE12-S00, LXK2-PE14-T00, LXK2-PE14-U00 LXK2-PB12-K00, LXK2-PB12-L00, LXK2-PB12-M00, LXK2-PB14-N00, LXK2-PB14-P00, LXK2-PB14-Q00 LXK2-PR12-L00, LXK2-PR12-M00, LXK2-PR14-Q00, LXK2-PR14-R00 LXK2-PD12-Q00, LXK2-PD12-R00, LXK2-PD12-S00 LXK2-PH12-R00, LXK2-PH12-S00 LXK2-PL12-P00, LXK2-PL12-Q00, LXK2-PL12-R00 Source: www.luxeon.com
LED18 = led:DUOLED-RG-C: DUO LED 2 colors (red/green), 5 mm, round, common Cathode www.ligitek.com or other producers.
M1 = ic-package:SIM5320_MODULE: SIM5320E 3G GPRS module from ebay. https://www.ebay.com/itm/SIM5320E-GPS-3G-MINI-Breakout-BOARD-Cellular-3G-WCDM-module-on-Board-for-Europe/263439662334?hash=item3d563a3cfe:g:VbYAAOSwS~FaXZy0&frcectupt=true&autorefresh=true
M2 = Teensy_3_and_LC_Series_Boards_v1.4:TEENSY_3.6_ALL_PINS&PADS: All pins and pads on the Teensy 3.6 exposed. Assumes the use of multiple, unshrouded headers to get access to the pads on the underside of the Teensy These headers should be a 2x5, 2x4, and a 2x3 with a 0.1" hole spacing / pitch.
OK1-OK3 = optocoupler:SFH618?*: Optocoupler, Phototransistor Output, Low Input Current Source: Data sheet <http://www.vishay.com/docs/83673/sfh618.pdf>; MF: VISHAY/TELEFUNKEN; MPN: SFH6186-2; OC_FARNELL: 1469583; OC_NEWARK: 58K2210
R1-R13 R15-R54 = resistor:R-EU_: RESISTOR, European symbol
R14 = varistor:S14K11: VARISTOR
REG1-REG3 = v-reg:78XXS: VOLTAGE REGULATOR
REG4 = pinhead:PINHD-1X4: PIN HEADER
S1 = switch:SKHMP*E010: 6.2 X 6.5mm TACT Switch (SMD) Source: http://www3.alps.co.jp/WebObjects/catalog.woa/PDF/E/Switch/Tact/SKHM/SKHM.PDF
SJ1 SJ3 = jumper:SJ: SMD solder JUMPER
SV1 = con-lsta:FE20-2: FEMALE HEADER; OC_FARNELL: unknown; OC_NEWARK: unknown
T1 = transistor-neu-to92:BC846: NPN TRANSISTOR
U1 U8 = Maxim_By_element14_Batch_1:MAX485CSA+: ±15kV ESD-Protected, Slew-Rate-Limited, Low-Power, RS-485/RS-422 Transceivers; MPN: MAX485CSA+; OC_FARNELL: 9725954; OC_NEWARK: 68K4795; PACKAGE: SOIC-8; SUPPLIER: Maxim
U3 = Maxim_By_element14_Batch_1:DS3231S: Extremely Accurate I2C-Integrated RTC/TCXO/Crystal; MPN: DS3231S#; OC_FARNELL: -; OC_NEWARK: 68K3404; PACKAGE: SOIC-16; SUPPLIER: Maxim
U4 = texas:ISO1050: ISOLATED CAN TRANSCEIVER Source: http://focus.ti.com/lit/ds/symlink/iso1050.pdf; MPN: ISO1050DUBR; OC_FARNELL: 1755712; OC_NEWARK: 14R9899
U5 = MAX6173:MAX6177AASA+
U6 = uln2803:ULN2803
WI-FI = esp12e:ESP8266-12E: ESP8266-12E Library for Eagle CAD The author not responsible for any damages or errors!. Created by Suhail jr.lt;/author>
X1 = con-wago-500:W237-4: WAGO SCREW CLAMP; OC_FARNELL: unknown; OC_NEWARK: unknown
X2 = JST XH Connectors v1-0:JST-XH-10-PIN: JST XH Connector 2 Pin Wire to board connector. Pitch: 2,54 mm, (0.100") Number of pins: 10 Created by Rembrandt Electronics www.rembrandtelectronics.com
X3 = con-wago-500:W237-102: WAGO SCREW CLAMP; MPN: 237-102; OC_FARNELL: unknown; OC_NEWARK: 70K9898
X4 = JST XH Connectors v1-0:JST-XH-08-PIN: JST XH Connector 2 Pin Wire to board connector. Pitch: 2,54 mm, (0.100") Number of pins: 8 Created by Rembrandt Electronics www.rembrandtelectronics.com
X6 X9 X10 = con-wago-500:W237-6: WAGO SCREW CLAMP; OC_FARNELL: unknown; OC_NEWARK: unknown
X7 = JST XH Connectors v1-0:JST-XH-07-PIN: JST XH Connector 2 Pin Wire to board connector. Pitch: 2,54 mm, (0.100") Number of pins: 7 Created by Rembrandt Electronics www.rembrandtelectronics.com
X8 = JST XH Connectors v1-0:JST-XH-05-PIN: JST XH Connector 2 Pin Wire to board connector. Pitch: 2,54 mm, (0.100") Number of pins: 5 Created by Rembrandt Electronics www.rembrandtelectronics.com
X11 = con-phoenix-508:MSTBA9: PHOENIX; MF: FARNELL; MPN: 1757310; OC_FARNELL: 3705237; OC_NEWARK: 71C4167

## Net classes
1 power: width 0.152 mm, drill 0.61 mm, clearance 0.229 mm
2 RS485 Differential: width 0.076 mm, drill 0.229 mm, clearance 0.229 mm